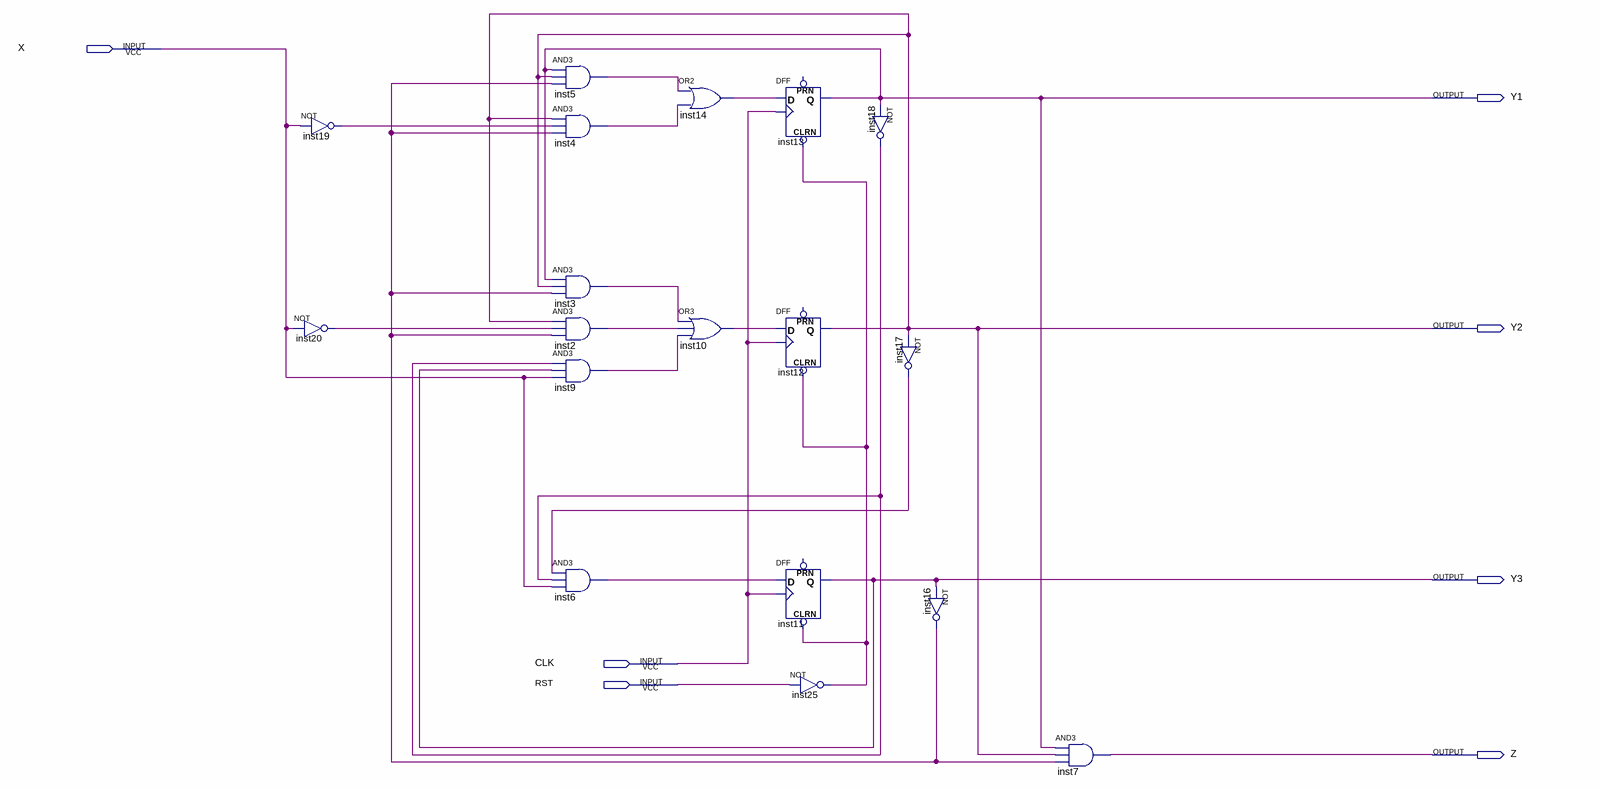
[diagram p0: schematic sheet]
// Quartus schematic Sequence_Recognizer.bdf as structural Verilog: 18 symbols, 7 pins
module Sequence_Recognizer (
  input  X,
  input  CLK,
  input  RST,
  output Y1,
  output Y2,
  output Y3,
  output Z
);

  wire inst2_out, inst3_out, inst4_out, inst5_out, inst6_out, inst9_out, inst10_out, inst14_out, inst16_out,
       inst17_out, inst18_out, inst19_out, inst20_out, inst25_out;

  not inst19 (inst19_out, X);
  not inst20 (inst20_out, X);
  and inst5 (inst5_out, Y1, Y2, inst16_out);
  and inst4 (inst4_out, Y2, inst19_out, inst16_out);
  and inst3 (inst3_out, Y1, Y2, inst16_out);
  and inst2 (inst2_out, Y2, inst20_out, inst16_out);
  and inst9 (inst9_out, inst18_out, Y3, X);
  and inst6 (inst6_out, inst17_out, inst18_out, X);
  or inst14 (inst14_out, inst5_out, inst4_out);
  or inst10 (inst10_out, inst3_out, inst2_out, inst9_out);
  DFF inst13 (.CLRN(inst25_out), .CLK(CLK), .D(inst14_out), .Q(Y1));  // open: PRN
  DFF inst12 (.CLRN(inst25_out), .CLK(CLK), .D(inst10_out), .Q(Y2));  // open: PRN
  DFF inst11 (.CLRN(inst25_out), .CLK(CLK), .D(inst6_out), .Q(Y3));  // open: PRN
  not inst25 (inst25_out, RST);
  not inst18 (inst18_out, Y1);
  not inst17 (inst17_out, Y2);
  not inst16 (inst16_out, Y3);
  and inst7 (Z, Y1, Y2, inst16_out);
endmodule
